# EAGLE schematic RP2350B_DEV_Template (EAGLE 9.2.1)
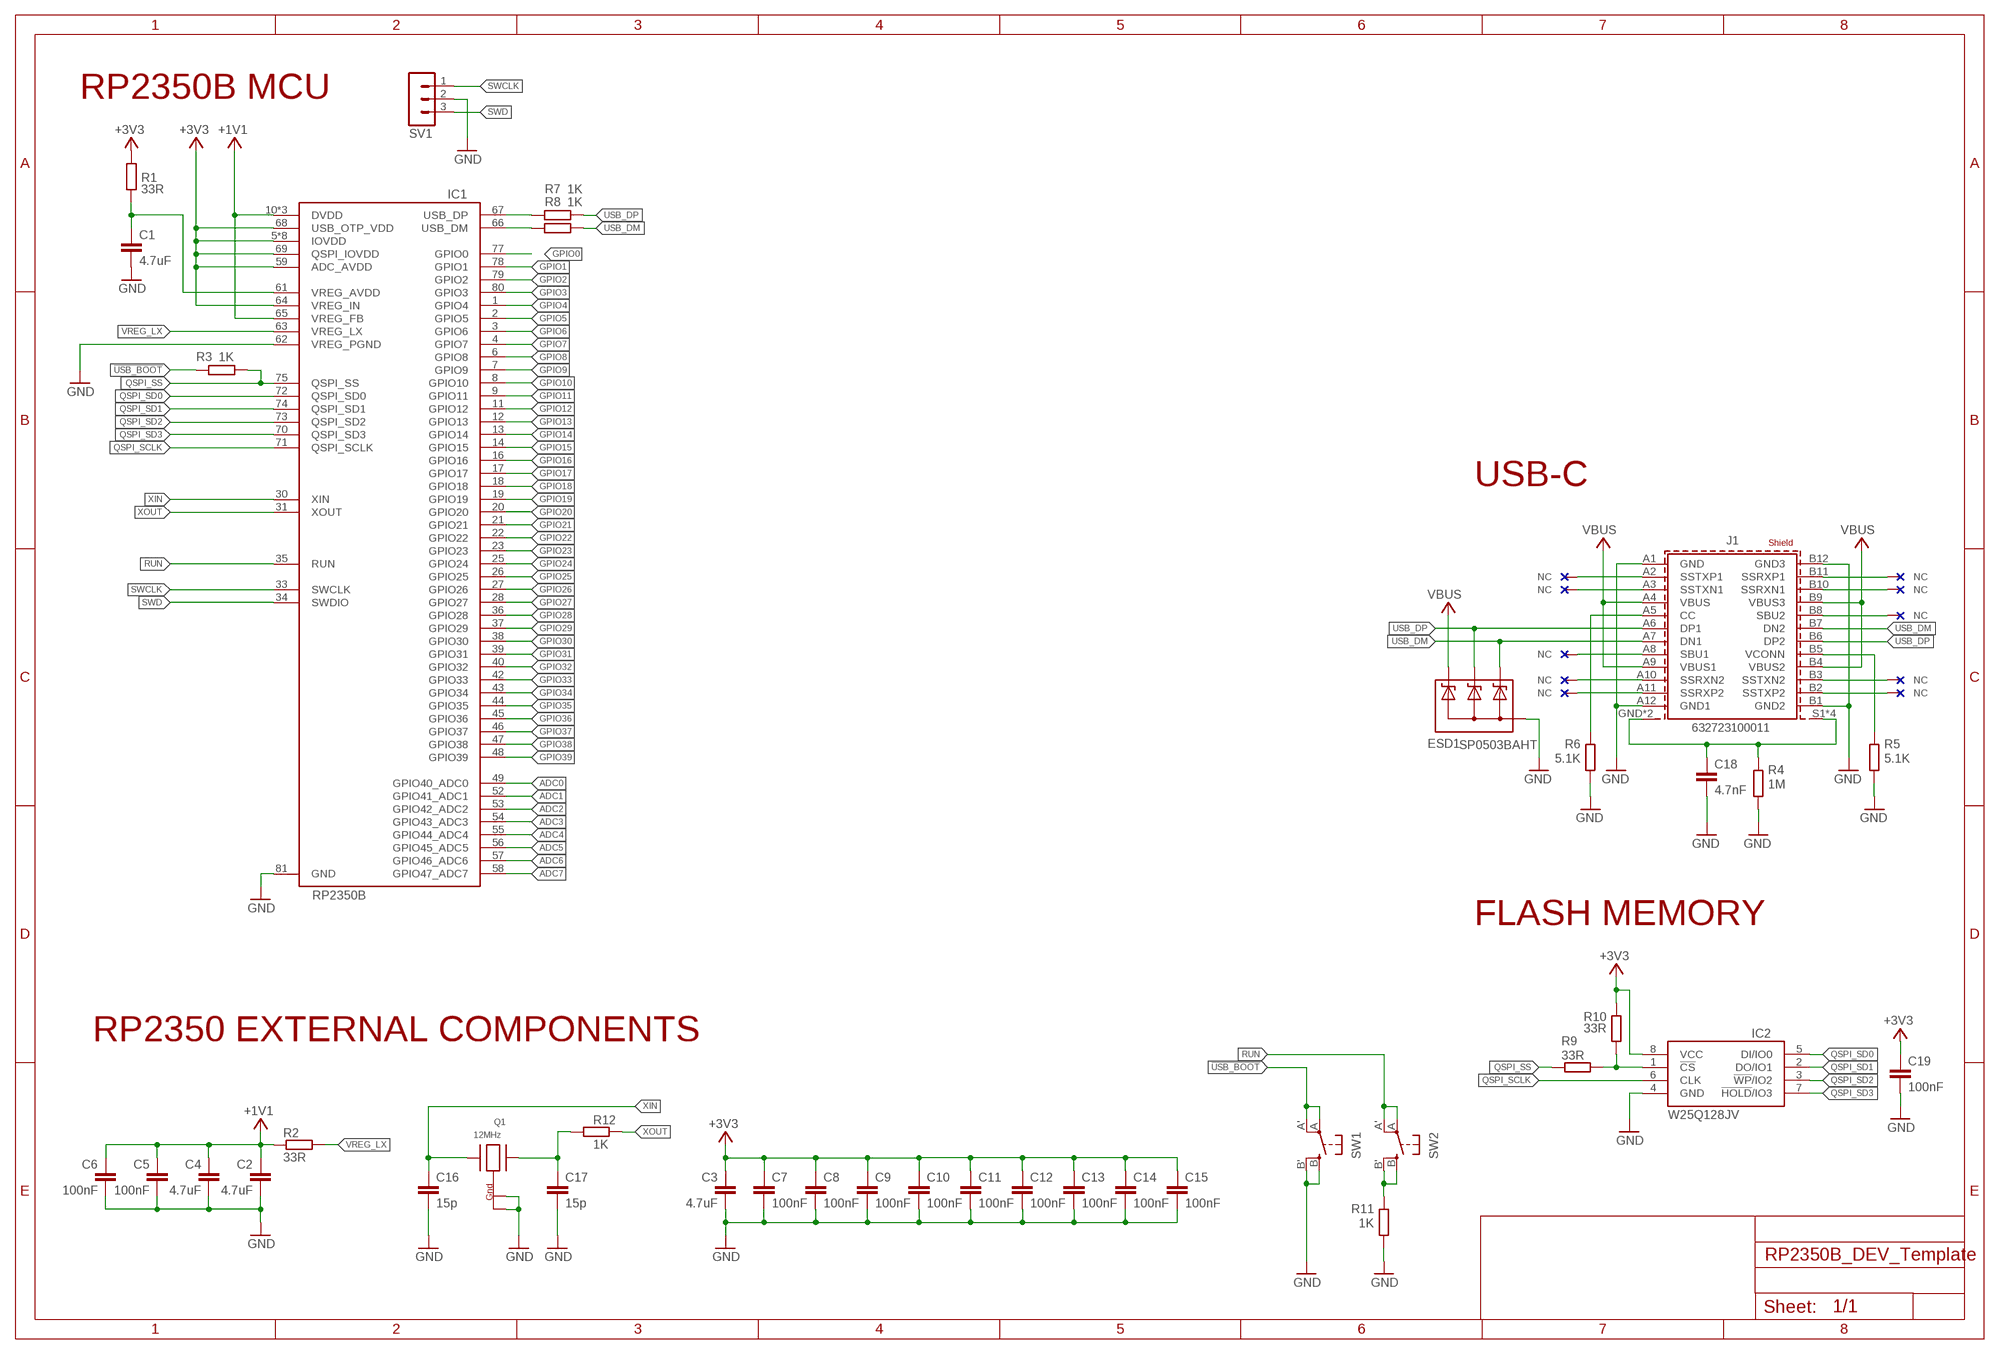
[diagram p0: schematic, sheet 1]

## Parts
C1  4.7uF  C-EUC0402K  [C0402K]
C2  4.7uF  C-EUC0402K  [C0402K]
C3  4.7uF  C-EUC0402K  [C0402K]
C4  4.7uF  C-EUC0402K  [C0402K]
C5  100nF  C-EUC0402K  [C0402K]
C6  100nF  C-EUC0402K  [C0402K]
C7  100nF  C-EUC0402K  [C0402K]
C8  100nF  C-EUC0402K  [C0402K]
C9  100nF  C-EUC0402K  [C0402K]
C10  100nF  C-EUC0402K  [C0402K]
C11  100nF  C-EUC0402K  [C0402K]
C12  100nF  C-EUC0402K  [C0402K]
C13  100nF  C-EUC0402K  [C0402K]
C14  100nF  C-EUC0402K  [C0402K]
C15  100nF  C-EUC0402K  [C0402K]
C16  15p  C-EUC0402K  [C0402K]
C17  15p  C-EUC0402K  [C0402K]
C18  4.7nF  C-EUC0402K  [C0402K]
C19  100nF  C-EUC0402K  [C0402K]
ESD1  SP0503BAHT  [SOT143]
IC1  RP2350BB  [QFN40P1000X1000X85-81T340N]
IC2  W25Q128JVP  [SON127P600X500X75-8N]
J1  632723100011  632723100011  [632723100011]
Q1  12MHz  XTAL-4-3225  [NX3225]
R1  33R  R-EU_R0402  [R0402]
R2  33R  R-EU_R0402  [R0402]
R3  1K  R-EU_R0402  [R0402]
R4  1M  R-EU_R0402  [R0402]
R5  5.1K  R-EU_R0402  [R0402]
R6  5.1K  R-EU_R0402  [R0402]
R7  1K  R-EU_R0402  [R0402]
R8  1K  R-EU_R0402  [R0402]
R9  33R  R-EU_R0402  [R0402]
R10  33R  R-EU_R0402  [R0402]
R11  1K  R-EU_R0402  [R0402]
R12  1K  R-EU_R0402  [R0402]
SV1  MA03-1  [MA03-1]
SW1  SPST_TACT-EVQQ2  [EVQ-Q2]
SW2  SPST_TACT-EVQQ2  [EVQ-Q2]

## Nets
!USB_BOOT: R3.1 SW1.A'(P1) SW1.A(P)
+1V1: C2.1 C4.1 C5.1 C6.1 IC1.10(DVDD) IC1.32(DVDD) IC1.51(DVDD) IC1.65(VREG_FB) R2.2
+3V3: C3.1 C7.1 C8.1 C9.1 C10.1 C11.1 C12.1 C13.1 C14.1 C15.1 C19.1 IC1.5(IOVDD) IC1.15(IOVDD) IC1.24(IOVDD) IC1.29(IOVDD) IC1.41(IOVDD) IC1.50(IOVDD) IC1.59(ADC_AVDD) IC1.60(IOVDD) IC1.64(VREG_IN) IC1.68(USB_OTP_VDD) IC1.69(QSPI_IOVDD) IC1.76(IOVDD) IC2.8(VCC) R1.1 R10.1
ADC0: IC1.49(GPIO40_ADC0)
ADC1: IC1.52(GPIO41_ADC1)
ADC2: IC1.53(GPIO42_ADC2)
ADC3: IC1.54(GPIO43_ADC3)
ADC4: IC1.55(GPIO44_ADC4)
ADC5: IC1.56(GPIO45_ADC5)
ADC6: IC1.57(GPIO46_ADC6)
ADC7: IC1.58(GPIO47_ADC7)
DM [DIFFPAIR]: IC1.66(USB_DM) R8.1
DP [DIFFPAIR]: IC1.67(USB_DP) R7.1
GND: C1.2 C2.2 C3.2 C4.2 C5.2 C6.2 C7.2 C8.2 C9.2 C10.2 C11.2 C12.2 C13.2 C14.2 C15.2 C16.2 C17.2 C18.2 C19.2 ESD1.1(A) IC1.62(VREG_PGND) IC1.81(GND) IC2.4(GND) J1.A1(GND) J1.A12(GND1) J1.B1(GND2) J1.B12(GND3) Q1.2(G2) Q1.4(G1) R4.1 R5.1 R6.1 R11.1 SV1.2 SW1.B'(S1) SW1.B(S)
GPIO0: IC1.77(GPIO0)
GPIO1: IC1.78(GPIO1)
GPIO2: IC1.79(GPIO2)
GPIO3: IC1.80(GPIO3)
GPIO4: IC1.1(GPIO4)
GPIO5: IC1.2(GPIO5)
GPIO6: IC1.3(GPIO6)
GPIO7: IC1.4(GPIO7)
GPIO8: IC1.6(GPIO8)
GPIO9: IC1.7(GPIO9)
GPIO10: IC1.8(GPIO10)
GPIO11: IC1.9(GPIO11)
GPIO12: IC1.11(GPIO12)
GPIO13: IC1.12(GPIO13)
GPIO14: IC1.13(GPIO14)
GPIO15: IC1.14(GPIO15)
GPIO16: IC1.16(GPIO16)
GPIO17: IC1.17(GPIO17)
GPIO18: IC1.18(GPIO18)
GPIO19: IC1.19(GPIO19)
GPIO20: IC1.20(GPIO20)
GPIO21: IC1.21(GPIO21)
GPIO22: IC1.22(GPIO22)
GPIO23: IC1.23(GPIO23)
GPIO24: IC1.25(GPIO24)
GPIO25: IC1.26(GPIO25)
GPIO26: IC1.27(GPIO26)
GPIO27: IC1.28(GPIO27)
GPIO28: IC1.36(GPIO28)
GPIO29: IC1.37(GPIO29)
GPIO30: IC1.38(GPIO30)
GPIO31: IC1.39(GPIO31)
GPIO32: IC1.40(GPIO32)
GPIO33: IC1.42(GPIO33)
GPIO34: IC1.43(GPIO34)
GPIO35: IC1.44(GPIO35)
GPIO36: IC1.45(GPIO36)
GPIO37: IC1.46(GPIO37)
GPIO38: IC1.47(GPIO38)
GPIO39: IC1.48(GPIO39)
N$1: C1.1 IC1.61(VREG_AVDD) R1.2
N$2: R11.2 SW2.B'(S1) SW2.B(S)
N$4: J1.B8(SBU2)
N$5: J1.A5(CC) R6.2
N$6: J1.B5(VCONN) R5.2
N$7: C18.1 J1.GND1(SHIELD) J1.GND(SHIELD) J1.S1(SHIELD1) J1.S2(SHIELD1) J1.S3(SHIELD1) J1.S4(SHIELD1) R4.2
N$9: J1.A2(SSTXP1)
N$10: J1.A3(SSTXN1)
N$11: J1.A10(SSRXN2)
N$12: J1.A11(SSRXP2)
N$13: J1.A8(SBU1)
N$15: J1.B11(SSRXP1)
N$16: J1.B10(SSRXN1)
N$17: J1.B3(SSTXN2)
N$18: J1.B2(SSTXP2)
N$19: IC2.1(!CS) R9.2 R10.2
OU: C17.1 Q1.1(X1) R12.1
QSPI_SCLK [DIFFPAIR]: IC1.71(QSPI_SCLK) IC2.6(CLK)
QSPI_SD0 [DIFFPAIR]: IC1.72(QSPI_SD0) IC2.5(DI/IO0)
QSPI_SD1 [DIFFPAIR]: IC1.74(QSPI_SD1) IC2.2(DO/IO1)
QSPI_SD2 [DIFFPAIR]: IC1.73(QSPI_SD2) IC2.3(!WP!/IO2)
QSPI_SD3 [DIFFPAIR]: IC1.70(QSPI_SD3) IC2.7(!HOLD!/IO3)
QSPI_SS [DIFFPAIR]: IC1.75(QSPI_SS) R3.2 R9.1
RUN: IC1.35(RUN) SW2.A'(P1) SW2.A(P)
SWCLK: IC1.33(SWCLK) SV1.1
SWD: IC1.34(SWDIO) SV1.3
USB_DM [DIFFPAIR]: ESD1.2(C1) J1.A7(DN1) J1.B7(DN2) R8.2
USB_DP [DIFFPAIR]: ESD1.3(C2) J1.A6(DP1) J1.B6(DP2) R7.2
VBUS: ESD1.4(C3) J1.A4(VBUS) J1.A9(VBUS1) J1.B4(VBUS2) J1.B9(VBUS3)
VREG_LX: IC1.63(VREG_LX) R2.1
XIN: C16.1 IC1.30(XIN) Q1.3(X2)
XOUT: IC1.31(XOUT) R12.2

## Notes on the sheet
- RP2350B MCU
- USB-C
- FLASH MEMORY
- RP2350 EXTERNAL COMPONENTS

## Library data of the parts
C1-C19 = rcl:C-EU: CAPACITOR, European symbol
ESD1 = MCU:SP0503BAHT: TVS Diode Arrays Surface Mount TVS Avalanche Diode Array
IC1 = MCU:RP2350B: RP2350 is a new family of microcontrollers from Raspberry Pi that offers significant enhancements over RP2040. Key features include: • Dual Cortex-M33 or Hazard3 processors at 150 MHz • 520 kB on-chip SRAM, in 10 independent banks • 8 kB of one-time-programmable storage (OTP) • Up to 16 MB of external QSPI flash/PSRAM via dedicated QSPI bus - Additional 16 MB flash/PSRAM accessible via optional second chip-select • On-chip switched-mode power supply to generate core voltage - Low-quiescent-current LDO mode can be enabled for sleep states • 2× on-chip PLLs for internal or external clock generation • Security features: - Optional boot signing, enforced by on-chip mask ROM, with key fingerprint in OTP - Protected OTP storage for optional boot decryption key - Global bus filtering based on Arm or RISC-V security/privilege levels - Peripherals, GPIOs and DMA channels individually assignable to security domains - Hardware mitigations for fault injection attacks - Hardware SHA-256 accelerator • Peripherals: - 2× UARTs - 2× SPI controllers - 2× I2C controllers - 24× PWM channels - USB 1.1 controller and PHY, with host and device support - 12× PIO state machines - 1× HSTX peripheral
IC2 = MCU:W25Q128JV: 3V 128M-BIT SERIAL FLASH MEMORY WITH DUAL/QUAD SPI & QPI & DTR
J1 = Eagle_WR-USB (rev22a):632723100011: WR-COM USB 3.1 Type C Receptacle Horizontal THT/SMT Kind Properties Durability:10 000 Mating cycles Connector Type:USB 3.1 Type C Gender:Receptacle Type:Horizontal General Information Operating Temperature:-40up to +105 °C Compliance:RoHS Electrical Properties Working Voltage:20V (DC) Withstanding Voltage:100V (AC) Contact Resistance:30 mΩ Material Properties Insulator Material:LCP Insulator Flammability Rating:UL94 V-0 Color:Black Contact Material:Brass Contact Plating:2µ” Gold over 30µ” Pd-Ni Contact Type:Stamped Shielding Material:Steel Shielding Plating:Matte Tin <https://www.we-online.com/catalog/media/o144501v209%20Family_WR-COM_632723x00011.jpg> Details see: https://www.we-online.com/catalog/en/COM_3_1_THR_SMT_TYPE_C_RECEPTACLE_HORIZONTAL/ Updated by Ella Wu 2021-09-28 2021 (C) Würth Elektronik; APPLICATION: USB 3.1; DATASHEET-URL: https://www.we-online.com/catalog/datasheet/632723100011 .pdf; GERDER: Receptacle; INTERFACE-TYPE: Type C; IR1: 5A; MOUNT: THR; PACKAGING: Tape and Reel; PART-NUMBER: 632723100011; PINS: 24; TYPE: Horizontal; WORKING-VOLTAGE: 20V(DC)
Q1 = adafruit:XTAL-4: Classic 4-pin 3.2 x 2.5mm crystal
R1-R12 = rcl:R-EU_: RESISTOR, European symbol
SV1 = con-lstb:MA03-1: PIN HEADER; OC_FARNELL: unknown; OC_NEWARK: unknown
SW1 SW2 = adafruit:SPST_TACT: SMT 6mm switch, EVQQ2 series http://www.ladyada.net/library/eagle

## Net classes
1 DIFFPAIR: width 0.2 mm, drill 0.2 mm, clearance 0.2 mm